# EAGLE design PWM Driver - Driver ONLY (EAGLE 5.07)
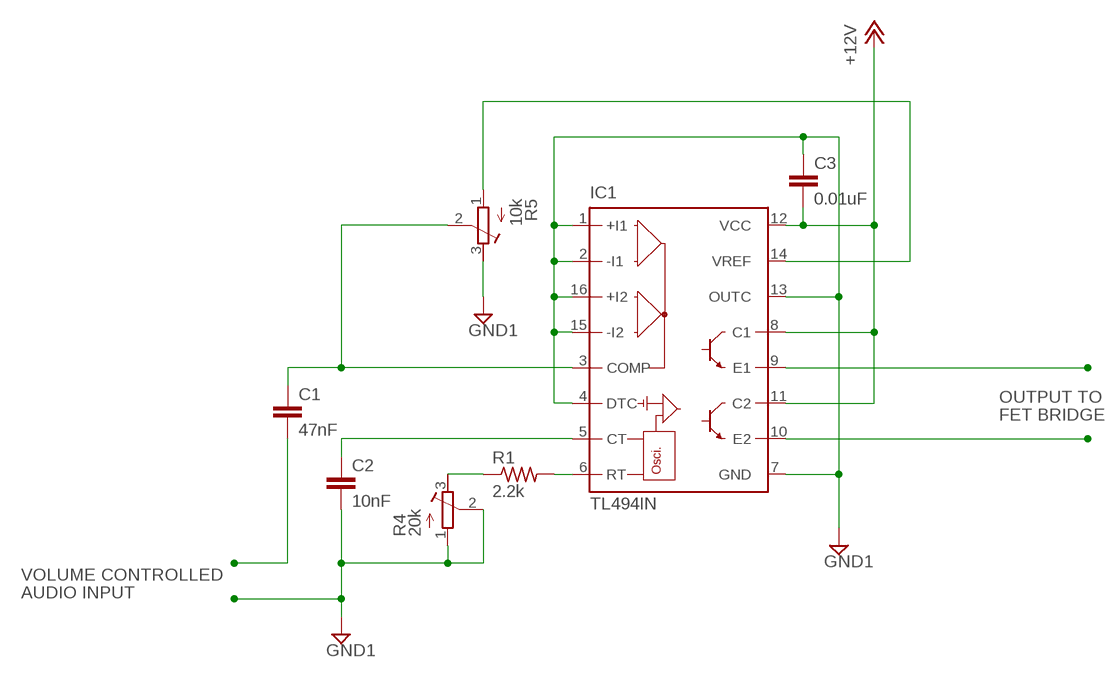
[diagram p0: schematic, sheet 1]

## Parts
C1  47nF  C-EU050-025X075  [C050-025X075]
C2  10nF  C-EU050-025X075  [C050-025X075]
C3  0.01uF  C-EU050-025X075  [C050-025X075]
IC1  TL494IN  [DIL16]
R1  2.2k  R-US_0207/10  [0207/10]
R4  20k  R-TRIMM64Z  [RTRIM64Z]
R5  10k  R-TRIMM64Z  [RTRIM64Z]

## Nets
+12V: C3.2 IC1.8(C1) IC1.11(C2) IC1.12(VCC)
GND1: C2.2 C3.1 IC1.1(+I1) IC1.2(-I1) IC1.4(DTC) IC1.7(GND) IC1.13(OUTC) IC1.15(-I2) IC1.16(+I2) R4.1(E) R4.2(S) R5.3(A)
N$1: IC1.14(VREF) R5.1(E)
N$2: IC1.9(E1)
N$3: IC1.10(E2)
N$4: IC1.6(RT) R1.2
N$5: C2.1 IC1.5(CT)
N$6: C1.2
N$7: R1.1 R4.3(A)
N$10: C1.1 IC1.3(COMP) R5.2(S)

## Notes on the sheet
- OUTPUT TO
- FET BRIDGE
- VOLUME CONTROLLED
- AUDIO INPUT

## Library data of the parts
C1-C3 = resistor:C-EU: CAPACITOR, European symbol
IC1 = linear:TL494*: SWITCHMODE Pulse Width Modulation Control Circuit NCV494B http://onsemi.com tl494-d.pdf
R1 = resistor:R-US_: RESISTOR, American symbol
R4 R5 = resistor:R-TRIMM: Trimm resistor

## Board
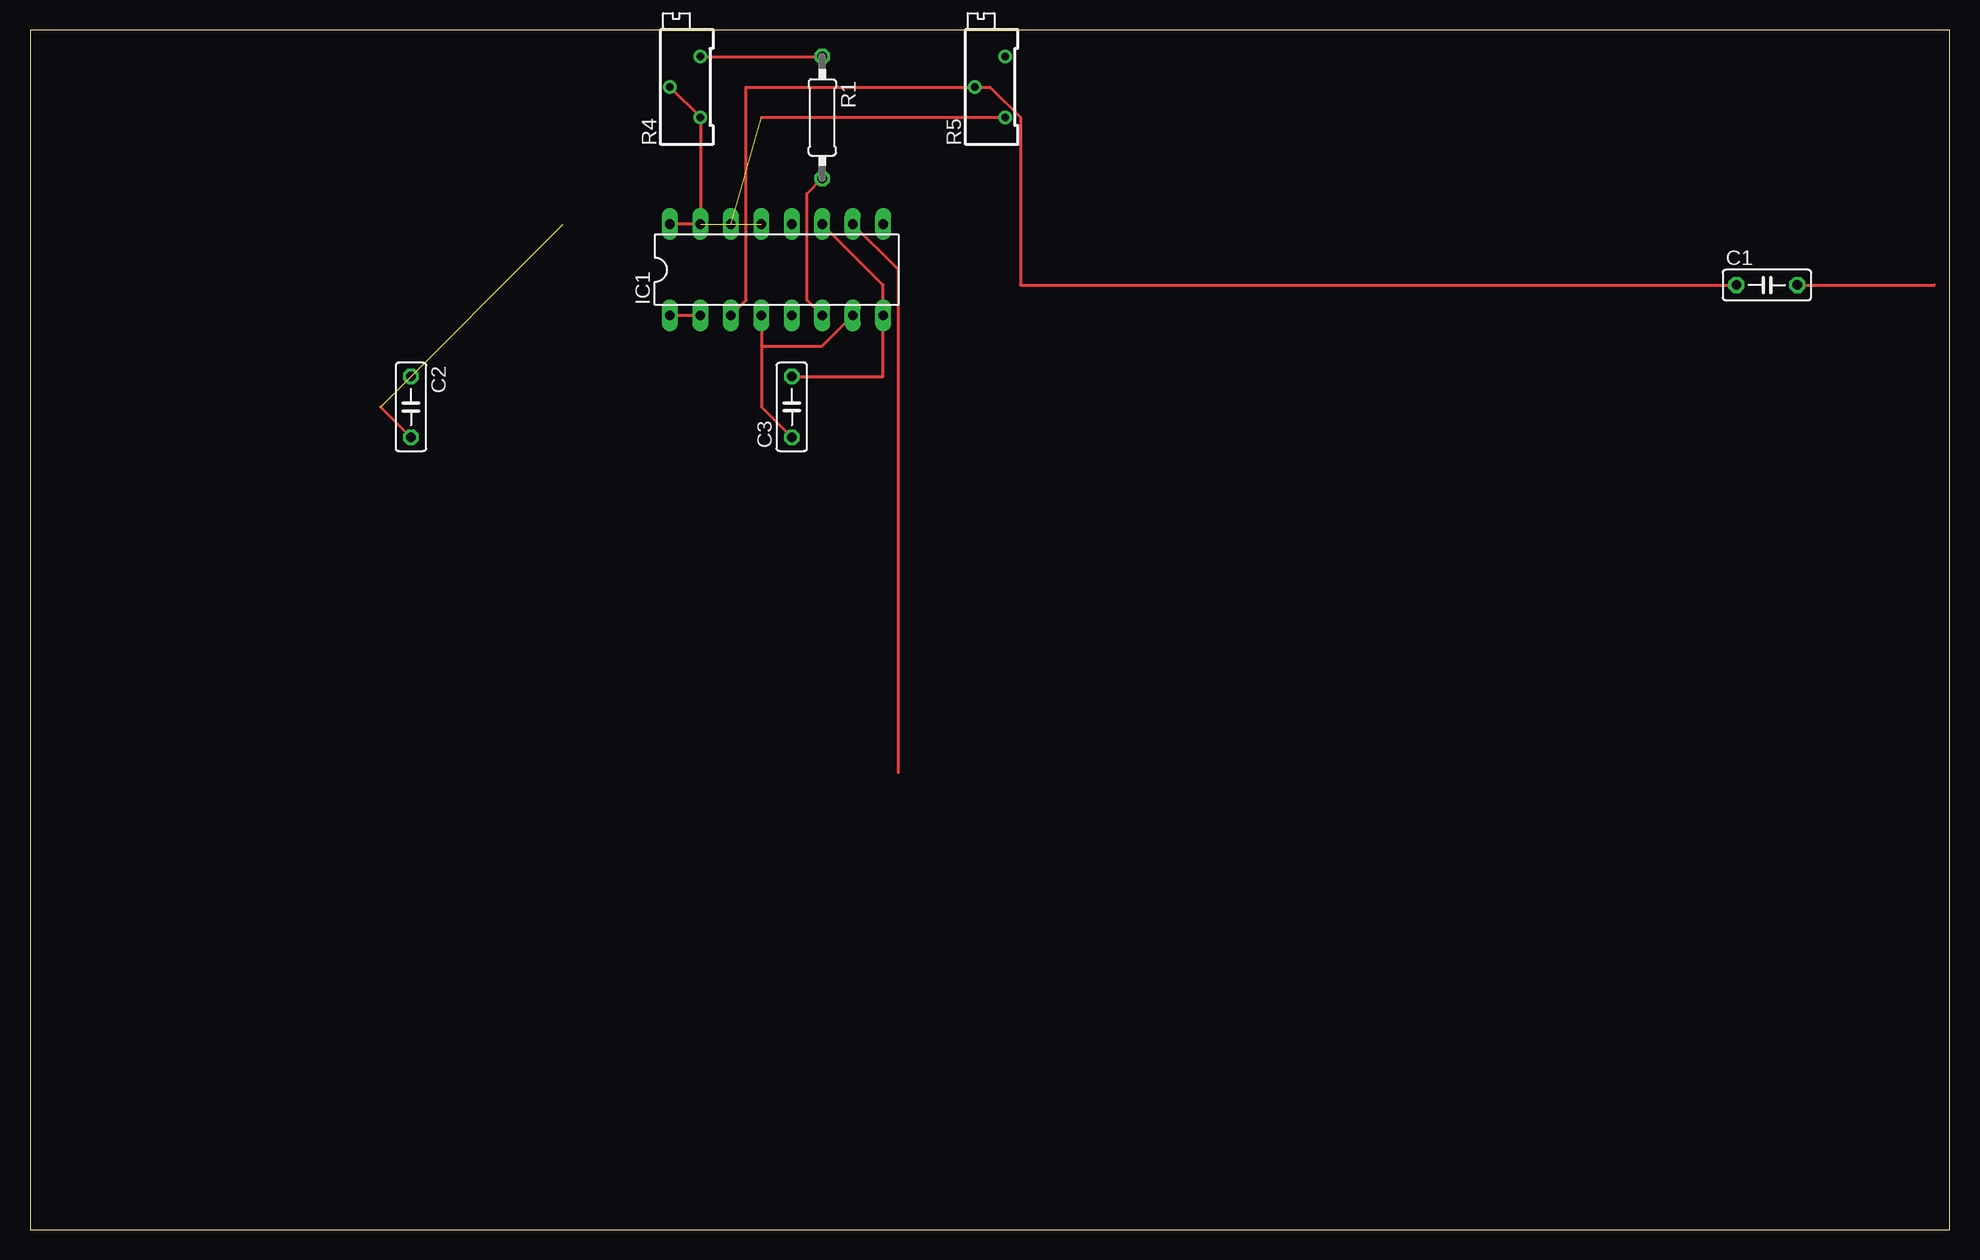
[diagram p1: board, top side]
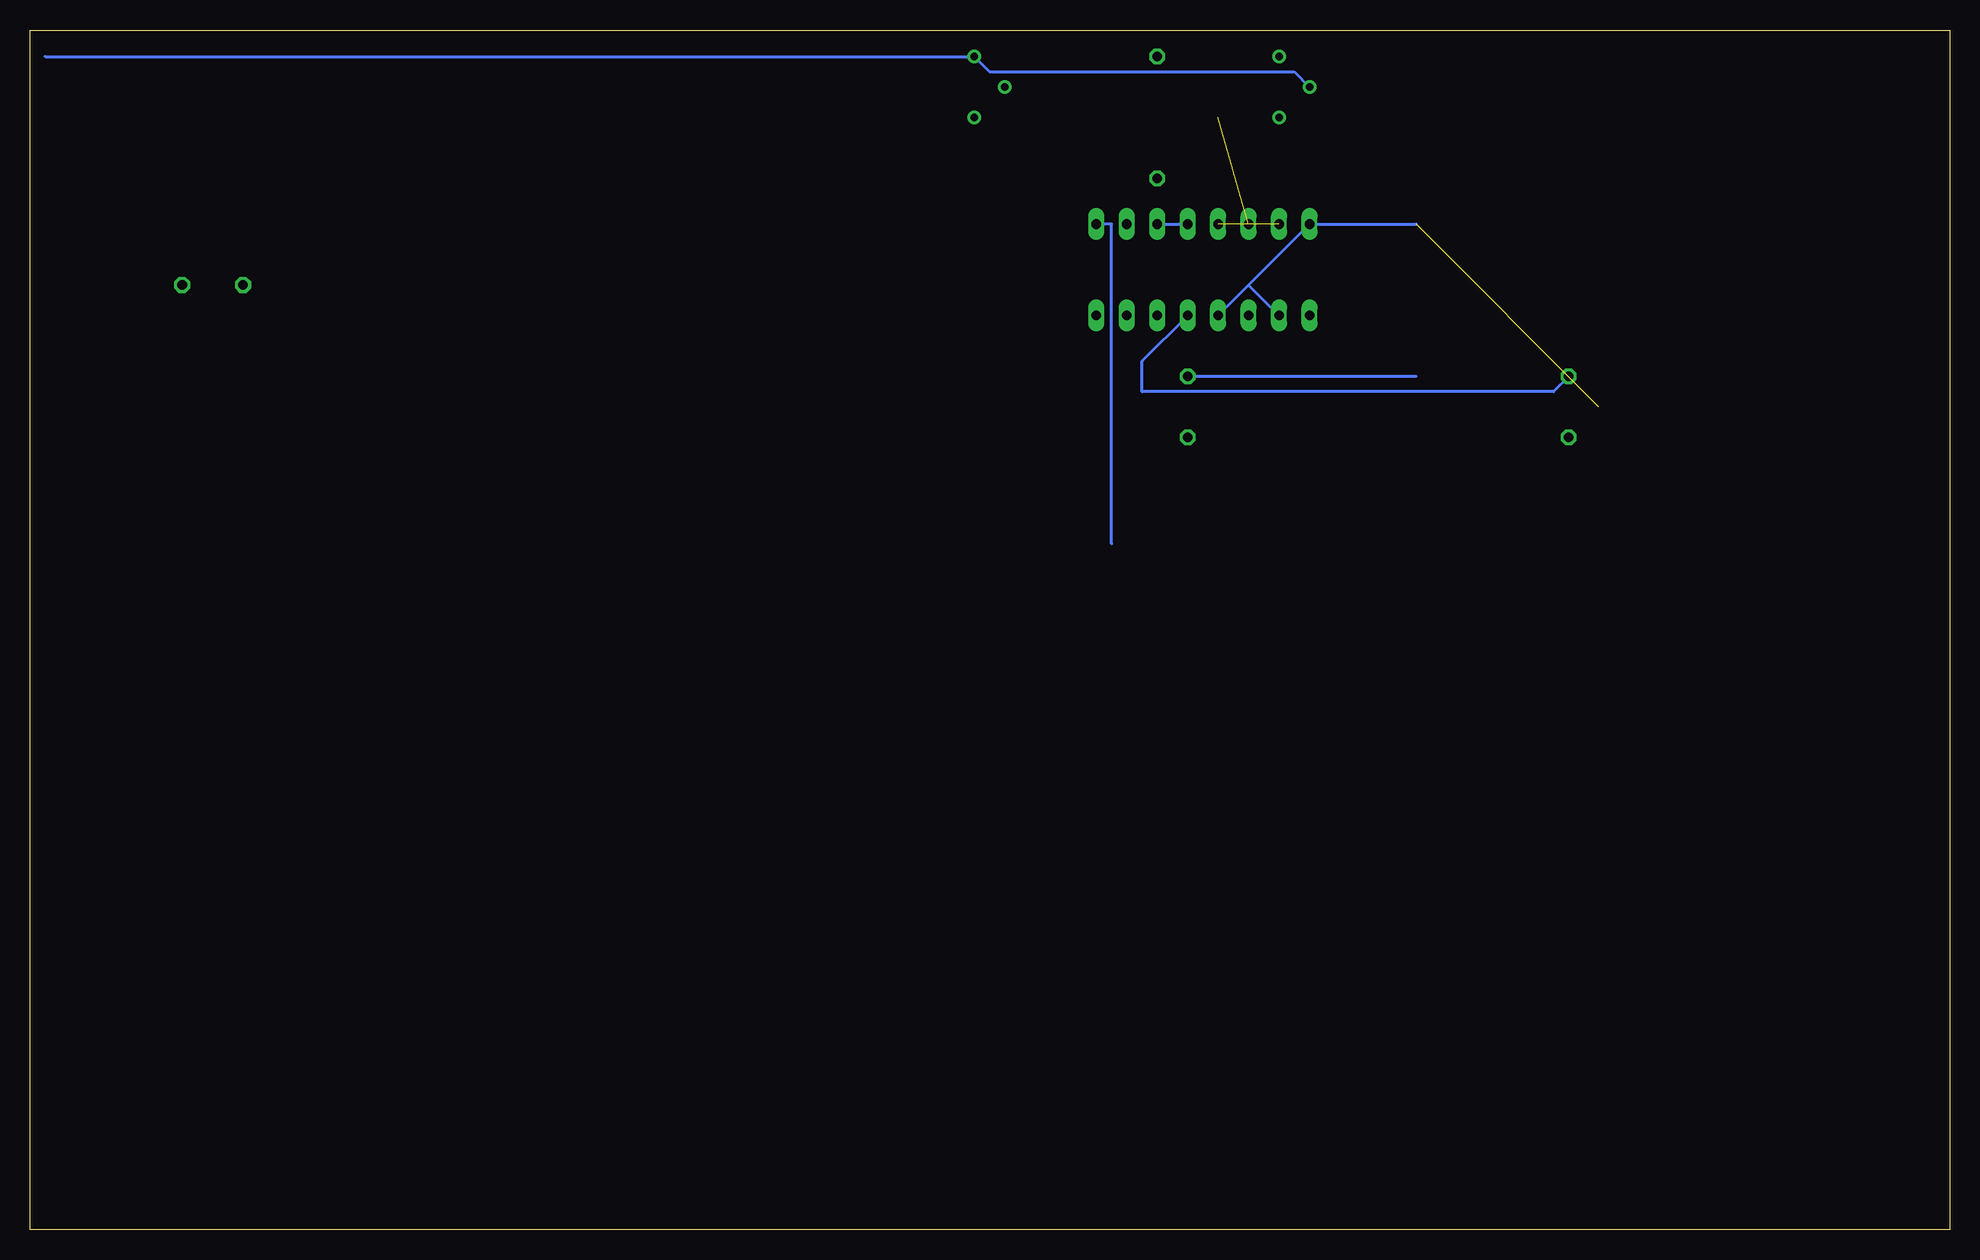
[diagram p2: board, bottom side, seen from below]

Size 160 x 100 mm. Coordinates in mm from the lower left corner, seen from the top.
Outline: 0,0 160,0 160,100 0,100 0,0
Copper layers (1*16): Top 0.035mm / dielectric 1.5mm / Bottom 0.035mm
Design rules "default": minimum track width 10mil, minimum drill 24mil, track to track 8mil, track to pad 8mil, pad to pad 8mil, via to via 8mil, smd to smd 8mil, copper to edge 40mil, drill to drill 8mil, minimum pad ring 10mil, minimum via ring 8mil, stop-mask expansion 4mil, vias tented up to drill 0mil, thermal gap 10mil

### Footprints (pad centres in the part's own frame; a part is rotated, then mirrored left to right if it is on the bottom)
C050-025X075 = drill 0.813 octagon: 1 -2.54,0; 2 2.54,0
DIL16 = drill 0.813 long: 1 -8.89,-3.81; 2 -6.35,-3.81; 3 -3.81,-3.81; 4 -1.27,-3.81; 5 1.27,-3.81; 6 3.81,-3.81; 7 6.35,-3.81; 8 8.89,-3.81; 9 8.89,3.81; 10 6.35,3.81; 11 3.81,3.81; 12 1.27,3.81; 13 -1.27,3.81; 14 -3.81,3.81; 15 -6.35,3.81; 16 -8.89,3.81
0207/10 = drill 0.813 octagon: 1 -5.08,0; 2 5.08,0
RTRIM64Z = drill 0.61 round: 1 0,-2.54; 2 -2.54,0; 3 0,2.54

### Placement (x,y rotation side)
C1  144.78,78.74 0 top
C2  31.75,68.58 270 top
C3  63.5,68.58 90 top
IC1  62.23,80.01 0 top
R1  66.04,92.71 270 top
R4  55.88,95.25 0 top
R5  81.28,95.25 0 top

### Tracks (layer width: path | path; a pad name or v marks a point on that pad's centre or on a via)
+12V
  Top 0.254: C3.2 71.12,71.12 IC1.8 71.12,78.74 IC1.11
  Bottom 0.254: IC1.11 IC1.12 | 44.45,71.12 C3.2
GND1  (2 unrouted)
  Top 0.254: C2.2 29.21,68.58 | IC1.2 IC1.1 | IC1.16 IC1.15 R4.1 R4.2 | C3.1 60.96,68.58 60.96,73.66 | IC1.4 60.96,73.66 | IC1.7 66.04,73.66 60.96,73.66
  Bottom 0.254: 58.42,78.74 IC1.16 44.45,83.82 | 58.42,78.74 IC1.4 | 58.42,78.74 IC1.2 | R4.2 54.61,96.52 80.01,96.52 R5.3 158.75,97.79
N$1  (1 unrouted)
  Top 0.254: 60.96,92.71 R5.1
N$2
  Bottom 0.254: 69.85,57.15 69.85,83.82 IC1.9
N$3
  Top 0.254: 72.39,38.1 72.39,80.01 IC1.10
N$4
  Top 0.254: IC1.6 64.77,77.47 64.77,86.36 R1.2
N$5
  Bottom 0.254: IC1.5 67.31,72.39 67.31,69.85 33.02,69.85 C2.1
N$6
  Top 0.254: C1.2 158.75,78.74
N$7
  Top 0.254: R4.3 R1.1
N$10
  Top 0.254: IC1.3 59.69,77.47 59.69,95.25 R5.2 80.01,95.25 82.55,92.71 82.55,78.74 C1.1